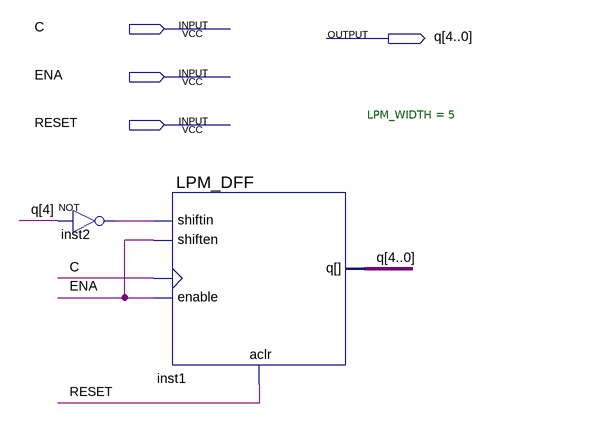
[diagram p0: schematic sheet]
// Quartus schematic johnson_counter.bdf as structural Verilog: 2 symbols, 4 pins
module johnson_counter (
  input  C,
  input  ENA,
  input  RESET,
  output [4:0] q
);

  wire inst2_out;

  not inst2 (inst2_out, q[4]);
  LPM_DFF #(.LPM_WIDTH(5)) inst1 (.aclr(RESET), .clock(C), .enable(ENA), .shiften(ENA), .shiftin(inst2_out), .q(q));
endmodule
